# Altium schematic sheet 5V-Switcher.SchDoc
size A
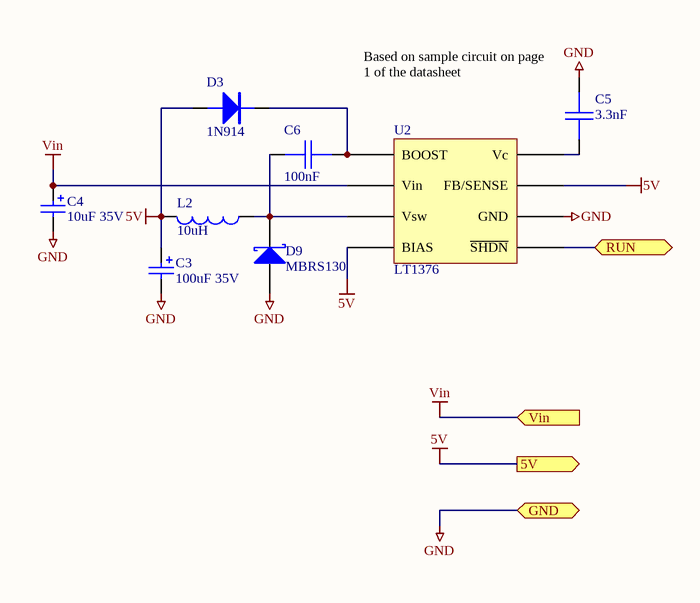
[diagram p0: 5V-Switcher.SchDoc]

## Parts
C3  100uF 35V  [MCCT-CASEC]
C4  10uF 35V  [MCCT-CASEC]
C5  3.3nF  [0603]
C6  100nF  [0603]
D3  1N914  [SMB]
D9  MBRS130  [SMB]
L2  10uH  [1812]
U2  LT1376  [SO8]

## Ports
5V, GND, RUN, Vin (in)

## Nets
5V: C3.1 D3.A L2.2 U2.4(BIAS) U2.7(FB/SENSE) ; port 5V
GND: C3.2 C4.2 C5.1 D9.A U2.6(GND) ; port GND
Vin: C4.1 U2.2(Vin) ; port Vin
RUN: U2.5(~{SHDN}) ; port RUN
NetC5_2: C5.2 U2.8(Vc)
NetC6_1: C6.1 D9.K L2.1 U2.3(Vsw)
NetC6_2: C6.2 D3.K U2.1(BOOST)

## Notes on the sheet
- Based on sample circuit on page 1 of the datasheet

## Library data of the parts
C3 C4 = Cap Pol3: Polarized Capacitor (Surface Mount); Value: 4.7uF; Revision: July-2002: Re-released for DXP Platform.; Farnell: 967-294; Price: 1.97
C5 = CAP: Capacitor; Value: 1nF; Revision: July-2002: Re-released for DXP Platform.; Farnell: 317-202; Price: 0.15
C6 = CAP: Capacitor; Value: 0.1uF; Revision: July-2002: Re-released for DXP Platform.; Farnell: 753-567; Price: 0.31
D3 = DIODE: Farnell: 302-3096; Price: 1.25
D9 = D SCHOTTKY: Schottky Diode; Revision: July-2002: Re-released for DXP Platform.; Farnell: 708-150; Price: 1.49
L2 = Inductor: Value: 330uH; Revision: July-2002: Re-released for DXP Platform.; Farnell: 200-451; Price: 2.90